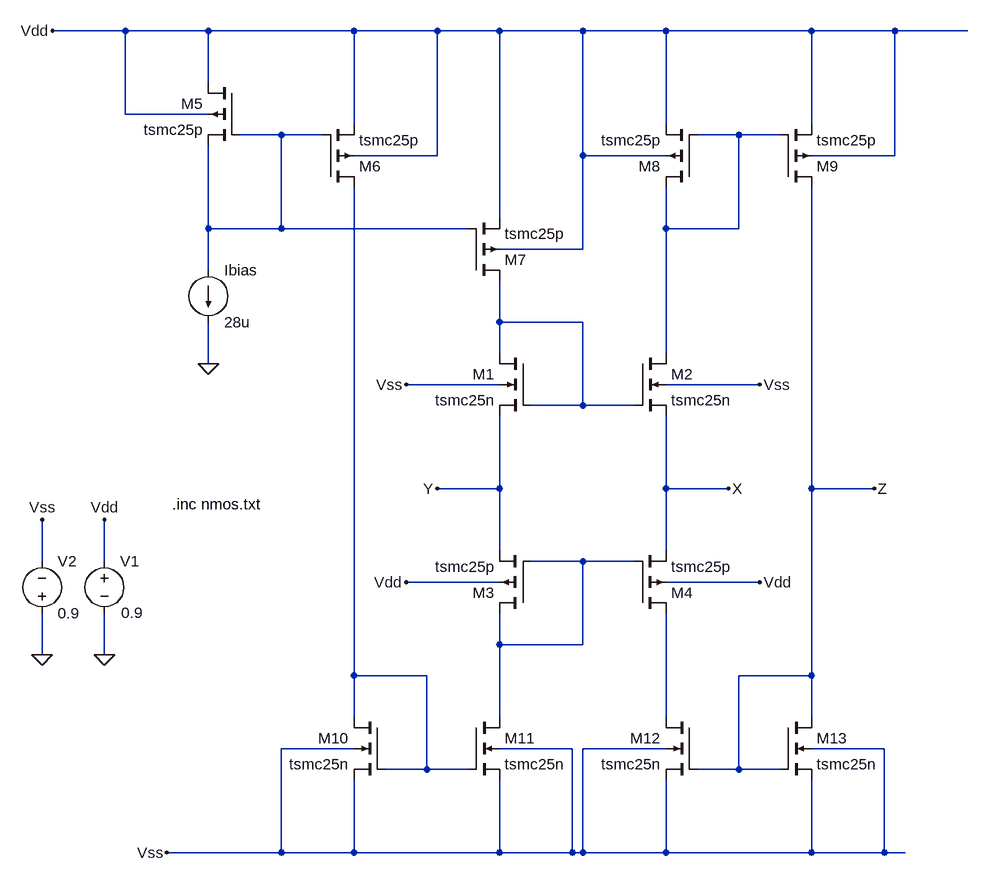
[diagram p0: schematic CCII_1.asc]
CCII_1.asc, the LTspice schematic file:
Version 4
SHEET 1 2612 1744
WIRE -144 400 -256 400
WIRE -16 400 -144 400
WIRE 208 400 -16 400
WIRE 336 400 208 400
WIRE 432 400 336 400
WIRE 560 400 432 400
WIRE 688 400 560 400
WIRE 912 400 688 400
WIRE 1040 400 912 400
WIRE 1152 400 1040 400
WIRE -16 480 -16 400
WIRE -144 528 -144 400
WIRE -16 528 -144 528
WIRE 208 544 208 400
WIRE 688 544 688 400
WIRE 912 544 912 400
WIRE 96 560 32 560
WIRE 160 560 96 560
WIRE 800 560 736 560
WIRE 864 560 800 560
WIRE 336 592 336 400
WIRE 336 592 208 592
WIRE 560 592 560 400
WIRE 688 592 560 592
WIRE 1040 592 1040 400
WIRE 1040 592 912 592
WIRE 432 688 432 400
WIRE -16 704 -16 576
WIRE 96 704 96 560
WIRE 96 704 -16 704
WIRE 384 704 96 704
WIRE 688 704 688 640
WIRE 800 704 800 560
WIRE 800 704 688 704
WIRE 560 736 560 592
WIRE 560 736 432 736
WIRE -16 768 -16 704
WIRE 432 848 432 784
WIRE 560 848 432 848
WIRE 432 896 432 848
WIRE 688 896 688 704
WIRE -16 912 -16 848
WIRE 432 944 288 944
WIRE 832 944 688 944
WIRE 560 976 560 848
WIRE 560 976 480 976
WIRE 640 976 560 976
WIRE 432 1104 432 992
WIRE 432 1104 336 1104
WIRE 688 1104 688 992
WIRE 784 1104 688 1104
WIRE 912 1104 912 640
WIRE 1008 1104 912 1104
WIRE 432 1200 432 1104
WIRE 688 1200 688 1104
WIRE -272 1216 -272 1152
WIRE -176 1216 -176 1152
WIRE 560 1216 480 1216
WIRE 640 1216 560 1216
WIRE 432 1248 288 1248
WIRE 832 1248 688 1248
WIRE 432 1344 432 1296
WIRE 560 1344 560 1216
WIRE 560 1344 432 1344
WIRE -272 1360 -272 1296
WIRE -176 1360 -176 1296
WIRE 208 1392 208 640
WIRE 320 1392 208 1392
WIRE 912 1392 912 1104
WIRE 912 1392 800 1392
WIRE 208 1456 208 1392
WIRE 432 1456 432 1344
WIRE 688 1456 688 1296
WIRE 912 1456 912 1392
WIRE 208 1504 96 1504
WIRE 544 1504 432 1504
WIRE 688 1504 560 1504
WIRE 1024 1504 912 1504
WIRE 320 1536 320 1392
WIRE 320 1536 256 1536
WIRE 384 1536 320 1536
WIRE 800 1536 800 1392
WIRE 800 1536 736 1536
WIRE 864 1536 800 1536
WIRE 96 1664 96 1504
WIRE 96 1664 -80 1664
WIRE 208 1664 208 1552
WIRE 208 1664 96 1664
WIRE 432 1664 432 1552
WIRE 432 1664 208 1664
WIRE 544 1664 544 1504
WIRE 544 1664 432 1664
WIRE 560 1664 560 1504
WIRE 560 1664 544 1664
WIRE 688 1664 688 1552
WIRE 688 1664 560 1664
WIRE 912 1664 912 1552
WIRE 912 1664 688 1664
WIRE 1024 1664 1024 1504
WIRE 1024 1664 912 1664
WIRE 1056 1664 1024 1664
FLAG -272 1360 0
FLAG -176 1360 0
FLAG -272 1152 Vss
FLAG -176 1152 Vdd
FLAG -256 400 Vdd
FLAG -80 1664 Vss
FLAG -16 912 0
FLAG 288 1248 Vdd
FLAG 832 1248 Vdd
FLAG 288 944 Vss
FLAG 832 944 Vss
FLAG 336 1104 Y
FLAG 784 1104 X
FLAG 1008 1104 Z
SYMBOL voltage -176 1200 R0
WINDOW 123 24 124 Left 2
WINDOW 39 0 0 Left 0
WINDOW 3 26 95 Left 2
SYMATTR Value 0.9
SYMATTR InstName V1
SYMBOL voltage -272 1312 M180
WINDOW 0 24 96 Left 2
WINDOW 3 24 16 Left 2
WINDOW 123 0 0 Left 0
WINDOW 39 0 0 Left 0
SYMATTR InstName V2
SYMATTR Value 0.9
SYMBOL pmos4 32 480 M0
SYMATTR InstName M5
SYMATTR Value tsmc25p
SYMATTR Value2 l=0.18u w=20u
SYMBOL pmos4 160 640 M180
SYMATTR InstName M6
SYMATTR Value tsmc25p
SYMATTR Value2 l=0.18u w=20u
SYMBOL current -16 768 R0
WINDOW 123 0 0 Left 0
WINDOW 39 0 0 Left 0
SYMATTR InstName Ibias
SYMATTR Value 28u
SYMBOL pmos4 384 784 M180
SYMATTR InstName M7
SYMATTR Value tsmc25p
SYMATTR Value2 l=0.18u w=22u
SYMBOL pmos4 736 640 R180
SYMATTR InstName M8
SYMATTR Value tsmc25p
SYMATTR Value2 l=0.18u w=28u
SYMBOL pmos4 864 640 M180
SYMATTR InstName M9
SYMATTR Value tsmc25p
SYMATTR Value2 l=0.18u w=28u
SYMBOL nmos4 480 896 M0
SYMATTR InstName M1
SYMATTR Value tsmc25n
SYMATTR Value2 l=0.18u w=60u
SYMBOL nmos4 640 896 R0
SYMATTR InstName M2
SYMATTR Value tsmc25n
SYMATTR Value2 l=0.18u w=60u
SYMBOL nmos4 384 1456 R0
SYMATTR InstName M11
SYMATTR Value tsmc25n
SYMATTR Value2 l=0.18u w=2u
SYMBOL nmos4 736 1456 M0
SYMATTR InstName M12
SYMATTR Value tsmc25n
SYMATTR Value2 l=0.18u w=17u
SYMBOL nmos4 256 1456 M0
SYMATTR InstName M10
SYMATTR Value tsmc25n
SYMATTR Value2 l=0.18u w=2u
SYMBOL nmos4 864 1456 R0
SYMATTR InstName M13
SYMATTR Value tsmc25n
SYMATTR Value2 l=0.18u w=17u
SYMBOL pmos4 640 1296 M180
SYMATTR InstName M4
SYMATTR Value tsmc25p
SYMATTR Value2 l=0.18u w=90u
SYMBOL pmos4 480 1296 R180
SYMATTR InstName M3
SYMATTR Value tsmc25p
SYMATTR Value2 l=0.18u w=90u
TEXT -72 1128 Left 2 !.inc nmos.txt

The netlist it stands for:
* CCII_1.asc
V1 Vdd 0 0.9
V2 0 Vss 0.9
M5 Vdd N001 N001 Vdd tsmc25p l=0.18u w=20u
M6 N005 N001 Vdd Vdd tsmc25p l=0.18u w=20u
Ibias N001 0 28u
M7 N003 N001 Vdd Vdd tsmc25p l=0.18u w=22u
M8 N002 N002 Vdd Vdd tsmc25p l=0.18u w=28u
M9 Z N002 Vdd Vdd tsmc25p l=0.18u w=28u
M1 N003 N003 Y Vss tsmc25n l=0.18u w=60u
M2 N002 N003 X Vss tsmc25n l=0.18u w=60u
M11 N004 N005 Vss Vss tsmc25n l=0.18u w=2u
M12 N006 Z Vss Vss tsmc25n l=0.18u w=17u
M10 N005 N005 Vss Vss tsmc25n l=0.18u w=2u
M13 Z Z Vss Vss tsmc25n l=0.18u w=17u
M4 N006 N004 X Vdd tsmc25p l=0.18u w=90u
M3 N004 N004 Y Vdd tsmc25p l=0.18u w=90u
.model NMOS NMOS
.model PMOS PMOS
.lib standard.mos
.inc nmos.txt
.backanno
.end